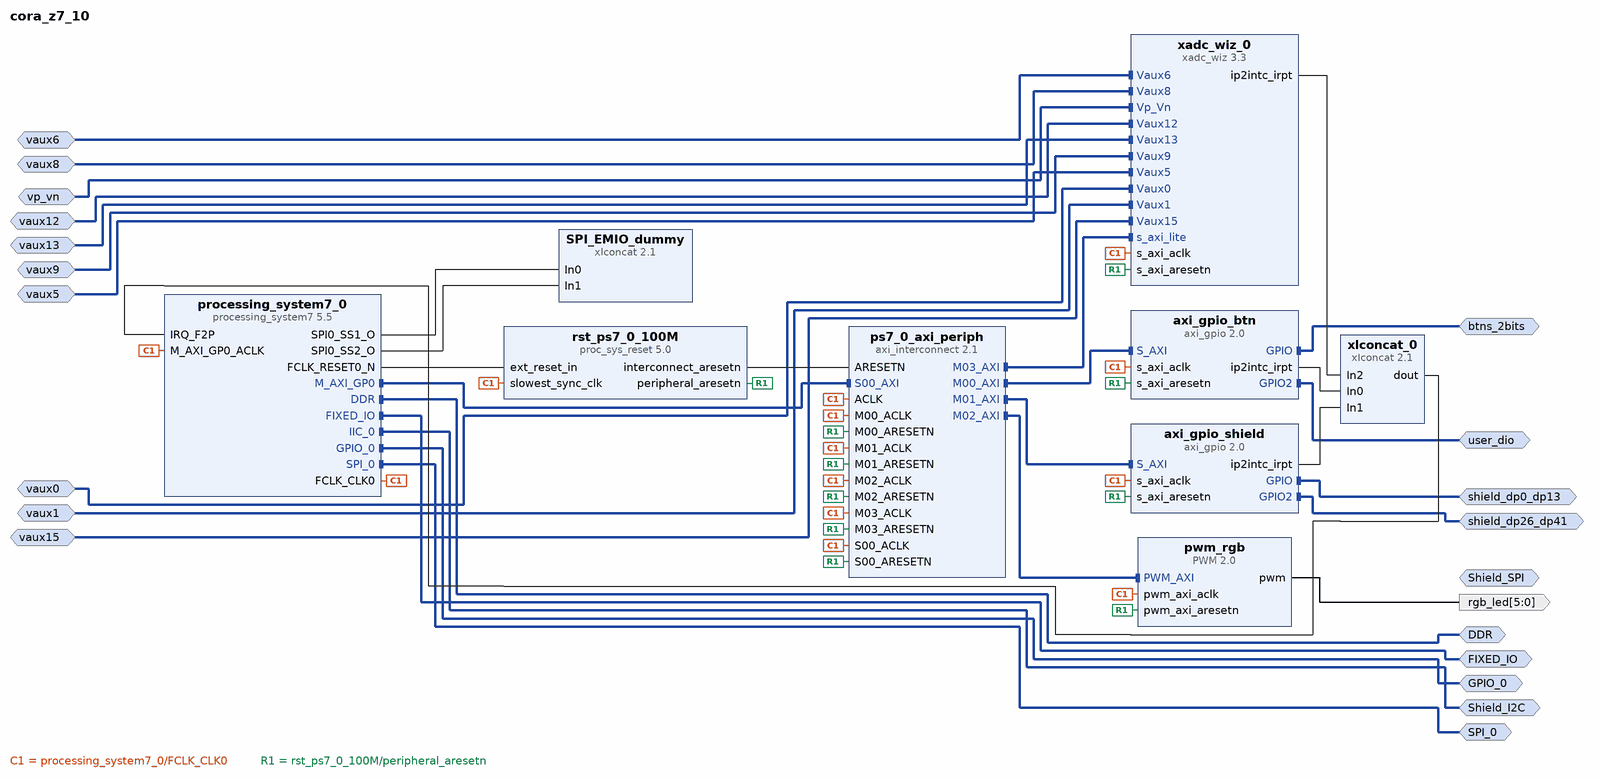
[diagram p0: block diagram of the top level]
# Vivado block design cora_z7_10, xc7z010clg400-1, Vivado 2017.4
create_bd_design cora_z7_10

create_bd_intf_port -mode Master -vlnv xilinx.com:interface:ddrx_rtl:1.0 DDR
create_bd_intf_port -mode Master -vlnv xilinx.com:display_processing_system7:fixedio_rtl:1.0 FIXED_IO
create_bd_intf_port -mode Master -vlnv xilinx.com:interface:iic_rtl:1.0 Shield_I2C
create_bd_intf_port -mode Master -vlnv xilinx.com:interface:gpio_rtl:1.0 btns_2bits
create_bd_intf_port -mode Master -vlnv xilinx.com:interface:gpio_rtl:1.0 user_dio
create_bd_intf_port -mode Master -vlnv xilinx.com:interface:gpio_rtl:1.0 shield_dp0_dp13
create_bd_intf_port -mode Master -vlnv xilinx.com:interface:gpio_rtl:1.0 shield_dp26_dp41
create_bd_intf_port -mode Slave -vlnv xilinx.com:interface:diff_analog_io_rtl:1.0 vaux6
create_bd_intf_port -mode Slave -vlnv xilinx.com:interface:diff_analog_io_rtl:1.0 vaux8
create_bd_intf_port -mode Slave -vlnv xilinx.com:interface:diff_analog_io_rtl:1.0 vp_vn
create_bd_intf_port -mode Slave -vlnv xilinx.com:interface:diff_analog_io_rtl:1.0 vaux12
create_bd_intf_port -mode Slave -vlnv xilinx.com:interface:diff_analog_io_rtl:1.0 vaux13
create_bd_intf_port -mode Slave -vlnv xilinx.com:interface:diff_analog_io_rtl:1.0 vaux9
create_bd_intf_port -mode Slave -vlnv xilinx.com:interface:diff_analog_io_rtl:1.0 vaux5
create_bd_intf_port -mode Slave -vlnv xilinx.com:interface:diff_analog_io_rtl:1.0 vaux0
create_bd_intf_port -mode Slave -vlnv xilinx.com:interface:diff_analog_io_rtl:1.0 vaux1
create_bd_intf_port -mode Slave -vlnv xilinx.com:interface:diff_analog_io_rtl:1.0 vaux15
create_bd_intf_port -mode Master -vlnv xilinx.com:interface:gpio_rtl:1.0 GPIO_0
create_bd_intf_port -mode Master -vlnv xilinx.com:interface:spi_rtl:1.0 SPI_0
create_bd_intf_port -mode Master -vlnv xilinx.com:interface:spi_rtl:1.0 Shield_SPI
create_bd_port -dir O -from 5 -to 0 rgb_led

create_bd_cell -type ip -vlnv xilinx.com:ip:processing_system7:5.5 processing_system7_0
set_property -dict [list \
  CONFIG.PCW_UIPARAM_DDR_FREQ_MHZ 525 \
  CONFIG.PCW_CRYSTAL_PERIPHERAL_FREQMHZ 50 \
  CONFIG.PCW_APU_PERIPHERAL_FREQMHZ 650 \
  CONFIG.PCW_SDIO_PERIPHERAL_FREQMHZ 50 \
  CONFIG.PCW_UART_PERIPHERAL_FREQMHZ 100 \
  CONFIG.PCW_I2C_PERIPHERAL_FREQMHZ 108.333336 \
  CONFIG.PCW_FPGA0_PERIPHERAL_FREQMHZ 100 \
  CONFIG.PCW_FPGA1_PERIPHERAL_FREQMHZ 200 \
  CONFIG.PCW_FPGA2_PERIPHERAL_FREQMHZ 120 \
  CONFIG.PCW_M_AXI_GP0_FREQMHZ 100 \
  CONFIG.PCW_USE_FABRIC_INTERRUPT 1 \
  CONFIG.PCW_GPIO_EMIO_GPIO_WIDTH 8 \
  CONFIG.PCW_UART0_BAUD_RATE 921600 \
  CONFIG.PCW_IRQ_F2P_INTR 1 \
  CONFIG.PCW_GP0_EN_MODIFIABLE_TXN 0 \
  CONFIG.PCW_GP1_EN_MODIFIABLE_TXN 0 \
  CONFIG.PCW_PERIPHERAL_BOARD_PRESET part0 \
  CONFIG.PCW_PRESET_BANK1_VOLTAGE {LVCMOS 1.8V} \
  CONFIG.PCW_UIPARAM_DDR_BUS_WIDTH {16 Bit} \
  CONFIG.PCW_UIPARAM_DDR_PARTNO {MT41K256M16 RE-125} \
  CONFIG.PCW_QSPI_PERIPHERAL_ENABLE 0 \
  CONFIG.PCW_ENET0_PERIPHERAL_ENABLE 1 \
  CONFIG.PCW_ENET0_ENET0_IO {MIO 16 .. 27} \
  CONFIG.PCW_ENET0_GRP_MDIO_ENABLE 1 \
  CONFIG.PCW_ENET0_GRP_MDIO_IO {MIO 52 .. 53} \
  CONFIG.PCW_ENET_RESET_ENABLE 1 \
  CONFIG.PCW_ENET_RESET_SELECT {Share reset pin} \
  CONFIG.PCW_ENET0_RESET_ENABLE 1 \
  CONFIG.PCW_ENET0_RESET_IO {MIO 9} \
  CONFIG.PCW_SD0_PERIPHERAL_ENABLE 1 \
  CONFIG.PCW_SD0_SD0_IO {MIO 40 .. 45} \
  CONFIG.PCW_SD0_GRP_CD_ENABLE 1 \
  CONFIG.PCW_SD0_GRP_CD_IO {MIO 47} \
  CONFIG.PCW_SD0_GRP_WP_ENABLE 0 \
  CONFIG.PCW_UART0_PERIPHERAL_ENABLE 1 \
  CONFIG.PCW_UART0_UART0_IO {MIO 14 .. 15} \
  CONFIG.PCW_UART1_PERIPHERAL_ENABLE 0 \
  CONFIG.PCW_SPI0_PERIPHERAL_ENABLE 1 \
  CONFIG.PCW_SPI0_SPI0_IO EMIO \
  CONFIG.PCW_USB0_PERIPHERAL_ENABLE 1 \
  CONFIG.PCW_USB0_USB0_IO {MIO 28 .. 39} \
  CONFIG.PCW_USB_RESET_ENABLE 1 \
  CONFIG.PCW_USB_RESET_SELECT {Share reset pin} \
  CONFIG.PCW_USB0_RESET_ENABLE 1 \
  CONFIG.PCW_USB0_RESET_IO {MIO 46} \
  CONFIG.PCW_I2C0_PERIPHERAL_ENABLE 1 \
  CONFIG.PCW_I2C0_I2C0_IO EMIO \
  CONFIG.PCW_I2C_RESET_ENABLE 1 \
  CONFIG.PCW_I2C_RESET_SELECT {Share reset pin} \
  CONFIG.PCW_GPIO_MIO_GPIO_ENABLE 1 \
  CONFIG.PCW_GPIO_MIO_GPIO_IO MIO \
  CONFIG.PCW_GPIO_EMIO_GPIO_ENABLE 1 \
  CONFIG.PCW_GPIO_EMIO_GPIO_IO 8 \
] [get_bd_cells processing_system7_0]
# 511 more settings of processing_system7_0 are not shown: defaults, MIO pin electricals, DDR timing, and values the tool derives
create_bd_cell -type ip -vlnv xilinx.com:ip:axi_gpio:2.0 axi_gpio_btn
set_property -dict [list \
  CONFIG.C_INTERRUPT_PRESENT 1 \
  CONFIG.USE_BOARD_FLOW true \
  CONFIG.GPIO_BOARD_INTERFACE btns_2bits \
  CONFIG.GPIO2_BOARD_INTERFACE user_dio \
] [get_bd_cells axi_gpio_btn]
create_bd_cell -type ip -vlnv xilinx.com:ip:axi_gpio:2.0 axi_gpio_shield
set_property -dict [list \
  CONFIG.C_INTERRUPT_PRESENT 1 \
  CONFIG.USE_BOARD_FLOW true \
  CONFIG.GPIO_BOARD_INTERFACE shield_dp0_dp13 \
  CONFIG.GPIO2_BOARD_INTERFACE shield_dp26_dp41 \
] [get_bd_cells axi_gpio_shield]
create_bd_cell -type ip -vlnv xilinx.com:ip:axi_interconnect:2.1 ps7_0_axi_periph
set_property -dict {CONFIG.NUM_MI 4} [get_bd_cells ps7_0_axi_periph]
create_bd_cell -type ip -vlnv xilinx.com:ip:proc_sys_reset:5.0 rst_ps7_0_100M
create_bd_cell -type ip -vlnv xilinx.com:ip:xlconcat:2.1 xlconcat_0
set_property -dict {CONFIG.NUM_PORTS 3} [get_bd_cells xlconcat_0]
create_bd_cell -type ip -vlnv xilinx.com:ip:xlconcat:2.1 SPI_EMIO_dummy
create_bd_cell -type ip -vlnv xilinx.com:ip:xadc_wiz:3.3 xadc_wiz_0
set_property -dict [list \
  CONFIG.XADC_STARUP_SELECTION channel_sequencer \
  CONFIG.SEQUENCER_MODE Continuous \
  CONFIG.USER_TEMP_ALARM false \
  CONFIG.ENABLE_VCCPINT_ALARM false \
  CONFIG.ENABLE_VCCPAUX_ALARM false \
  CONFIG.SINGLE_CHANNEL_SELECTION TEMPERATURE \
  CONFIG.EXTERNAL_MUX_CHANNEL VP_VN \
  CONFIG.CHANNEL_ENABLE_CALIBRATION true \
  CONFIG.CHANNEL_ENABLE_TEMPERATURE true \
  CONFIG.CHANNEL_ENABLE_VCCINT true \
  CONFIG.CHANNEL_ENABLE_VCCAUX true \
  CONFIG.CHANNEL_ENABLE_VP_VN true \
  CONFIG.CHANNEL_ENABLE_VREFP true \
  CONFIG.CHANNEL_ENABLE_VREFN true \
  CONFIG.CHANNEL_ENABLE_VBRAM true \
  CONFIG.CHANNEL_ENABLE_VCCPINT true \
  CONFIG.CHANNEL_ENABLE_VCCPAUX true \
  CONFIG.CHANNEL_ENABLE_VCCDDRO true \
  CONFIG.CHANNEL_ENABLE_VAUXP0_VAUXN0 true \
  CONFIG.CHANNEL_ENABLE_VAUXP1_VAUXN1 true \
  CONFIG.CHANNEL_ENABLE_VAUXP5_VAUXN5 true \
  CONFIG.CHANNEL_ENABLE_VAUXP6_VAUXN6 true \
  CONFIG.CHANNEL_ENABLE_VAUXP8_VAUXN8 true \
  CONFIG.CHANNEL_ENABLE_VAUXP9_VAUXN9 true \
  CONFIG.CHANNEL_ENABLE_VAUXP12_VAUXN12 true \
  CONFIG.CHANNEL_ENABLE_VAUXP13_VAUXN13 true \
  CONFIG.CHANNEL_ENABLE_VAUXP15_VAUXN15 true \
] [get_bd_cells xadc_wiz_0]
create_bd_cell -type ip -vlnv digilentinc.com:IP:PWM:2.0 pwm_rgb
set_property -dict {CONFIG.NUM_PWM 6} [get_bd_cells pwm_rgb]

# ---- connections ----

connect_bd_intf_net [get_bd_intf_pins processing_system7_0/M_AXI_GP0] [get_bd_intf_pins ps7_0_axi_periph/S00_AXI]
connect_bd_intf_net [get_bd_intf_pins ps7_0_axi_periph/M00_AXI] [get_bd_intf_pins axi_gpio_btn/S_AXI]
connect_bd_intf_net [get_bd_intf_pins ps7_0_axi_periph/M01_AXI] [get_bd_intf_pins axi_gpio_shield/S_AXI]
connect_bd_intf_net [get_bd_intf_pins ps7_0_axi_periph/M02_AXI] [get_bd_intf_pins pwm_rgb/PWM_AXI]
connect_bd_intf_net [get_bd_intf_pins ps7_0_axi_periph/M03_AXI] [get_bd_intf_pins xadc_wiz_0/s_axi_lite]
connect_bd_intf_net [get_bd_intf_ports DDR] [get_bd_intf_pins processing_system7_0/DDR]
connect_bd_intf_net [get_bd_intf_ports FIXED_IO] [get_bd_intf_pins processing_system7_0/FIXED_IO]
connect_bd_intf_net [get_bd_intf_ports Shield_I2C] [get_bd_intf_pins processing_system7_0/IIC_0]
connect_bd_intf_net -intf_net axi_gpio_0_GPIO [get_bd_intf_ports btns_2bits] [get_bd_intf_pins axi_gpio_btn/GPIO]
connect_bd_intf_net -intf_net axi_gpio_0_GPIO2 [get_bd_intf_ports user_dio] [get_bd_intf_pins axi_gpio_btn/GPIO2]
connect_bd_intf_net -intf_net axi_gpio_1_GPIO [get_bd_intf_ports shield_dp0_dp13] [get_bd_intf_pins axi_gpio_shield/GPIO]
connect_bd_intf_net -intf_net axi_gpio_1_GPIO2 [get_bd_intf_ports shield_dp26_dp41] [get_bd_intf_pins axi_gpio_shield/GPIO2]
connect_bd_intf_net -intf_net Vaux6_0_1 [get_bd_intf_ports vaux6] [get_bd_intf_pins xadc_wiz_0/Vaux6]
connect_bd_intf_net -intf_net Vaux8_0_1 [get_bd_intf_ports vaux8] [get_bd_intf_pins xadc_wiz_0/Vaux8]
connect_bd_intf_net -intf_net Vp_Vn_0_1 [get_bd_intf_ports vp_vn] [get_bd_intf_pins xadc_wiz_0/Vp_Vn]
connect_bd_intf_net -intf_net Vaux12_0_1 [get_bd_intf_ports vaux12] [get_bd_intf_pins xadc_wiz_0/Vaux12]
connect_bd_intf_net -intf_net Vaux13_0_1 [get_bd_intf_ports vaux13] [get_bd_intf_pins xadc_wiz_0/Vaux13]
connect_bd_intf_net -intf_net Vaux9_0_1 [get_bd_intf_ports vaux9] [get_bd_intf_pins xadc_wiz_0/Vaux9]
connect_bd_intf_net -intf_net Vaux5_0_1 [get_bd_intf_ports vaux5] [get_bd_intf_pins xadc_wiz_0/Vaux5]
connect_bd_intf_net -intf_net Vaux0_0_1 [get_bd_intf_ports vaux0] [get_bd_intf_pins xadc_wiz_0/Vaux0]
connect_bd_intf_net -intf_net Vaux1_0_1 [get_bd_intf_ports vaux1] [get_bd_intf_pins xadc_wiz_0/Vaux1]
connect_bd_intf_net -intf_net Vaux15_0_1 [get_bd_intf_ports vaux15] [get_bd_intf_pins xadc_wiz_0/Vaux15]
connect_bd_intf_net [get_bd_intf_ports GPIO_0] [get_bd_intf_pins processing_system7_0/GPIO_0]
connect_bd_intf_net [get_bd_intf_ports SPI_0] [get_bd_intf_pins processing_system7_0/SPI_0]
connect_bd_net [get_bd_pins processing_system7_0/FCLK_CLK0] \
  [get_bd_pins processing_system7_0/M_AXI_GP0_ACLK] [get_bd_pins rst_ps7_0_100M/slowest_sync_clk] \
  [get_bd_pins axi_gpio_btn/s_axi_aclk] [get_bd_pins axi_gpio_shield/s_axi_aclk] [get_bd_pins xadc_wiz_0/s_axi_aclk] \
  [get_bd_pins pwm_rgb/pwm_axi_aclk] [get_bd_pins ps7_0_axi_periph/S00_ACLK] [get_bd_pins ps7_0_axi_periph/M00_ACLK] \
  [get_bd_pins ps7_0_axi_periph/ACLK] [get_bd_pins ps7_0_axi_periph/M01_ACLK] [get_bd_pins ps7_0_axi_periph/M02_ACLK] \
  [get_bd_pins ps7_0_axi_periph/M03_ACLK]
connect_bd_net [get_bd_pins processing_system7_0/FCLK_RESET0_N] [get_bd_pins rst_ps7_0_100M/ext_reset_in]
connect_bd_net [get_bd_pins rst_ps7_0_100M/peripheral_aresetn] \
  [get_bd_pins axi_gpio_btn/s_axi_aresetn] [get_bd_pins axi_gpio_shield/s_axi_aresetn] [get_bd_pins xadc_wiz_0/s_axi_aresetn] \
  [get_bd_pins pwm_rgb/pwm_axi_aresetn] [get_bd_pins ps7_0_axi_periph/S00_ARESETN] [get_bd_pins ps7_0_axi_periph/M00_ARESETN] \
  [get_bd_pins ps7_0_axi_periph/M01_ARESETN] [get_bd_pins ps7_0_axi_periph/M02_ARESETN] \
  [get_bd_pins ps7_0_axi_periph/M03_ARESETN]
connect_bd_net [get_bd_pins rst_ps7_0_100M/interconnect_aresetn] [get_bd_pins ps7_0_axi_periph/ARESETN]
connect_bd_net [get_bd_pins axi_gpio_btn/ip2intc_irpt] [get_bd_pins xlconcat_0/In0]
connect_bd_net [get_bd_pins axi_gpio_shield/ip2intc_irpt] [get_bd_pins xlconcat_0/In1]
connect_bd_net [get_bd_pins xlconcat_0/dout] [get_bd_pins processing_system7_0/IRQ_F2P]
connect_bd_net -net PWM_0_pwm [get_bd_pins pwm_rgb/pwm] [get_bd_ports rgb_led]
connect_bd_net [get_bd_pins processing_system7_0/SPI0_SS1_O] [get_bd_pins SPI_EMIO_dummy/In0]
connect_bd_net [get_bd_pins processing_system7_0/SPI0_SS2_O] [get_bd_pins SPI_EMIO_dummy/In1]
connect_bd_net [get_bd_pins xadc_wiz_0/ip2intc_irpt] [get_bd_pins xlconcat_0/In2]

# ---- address map ----
assign_bd_address -offset 0x41200000 -range 64K -target_address_space [get_bd_addr_spaces processing_system7_0/Data] [get_bd_addr_segs axi_gpio_btn/S_AXI/Reg]
assign_bd_address -offset 0x41210000 -range 64K -target_address_space [get_bd_addr_spaces processing_system7_0/Data] [get_bd_addr_segs axi_gpio_shield/S_AXI/Reg]
assign_bd_address -offset 0x43C00000 -range 64K -target_address_space [get_bd_addr_spaces processing_system7_0/Data] [get_bd_addr_segs pwm_rgb/PWM_AXI/PWM_AXI_reg]
assign_bd_address -offset 0x43C10000 -range 64K -target_address_space [get_bd_addr_spaces processing_system7_0/Data] [get_bd_addr_segs xadc_wiz_0/s_axi_lite/Reg]

validate_bd_design
save_bd_design
